# EasyEDA Pro project 数控电源.eprj, schematic 开关电源1号

## Sheets
1 CORE: Board Name: 开关电源一号; Create Date: 2025-11-23; Page Name: CORE; Project Name: 数控电源; Schematic Name: 开关电源1号; Update Date: 2025-11-23; Company: 嘉立创EDA; Page Size: A4; Version: V1.0
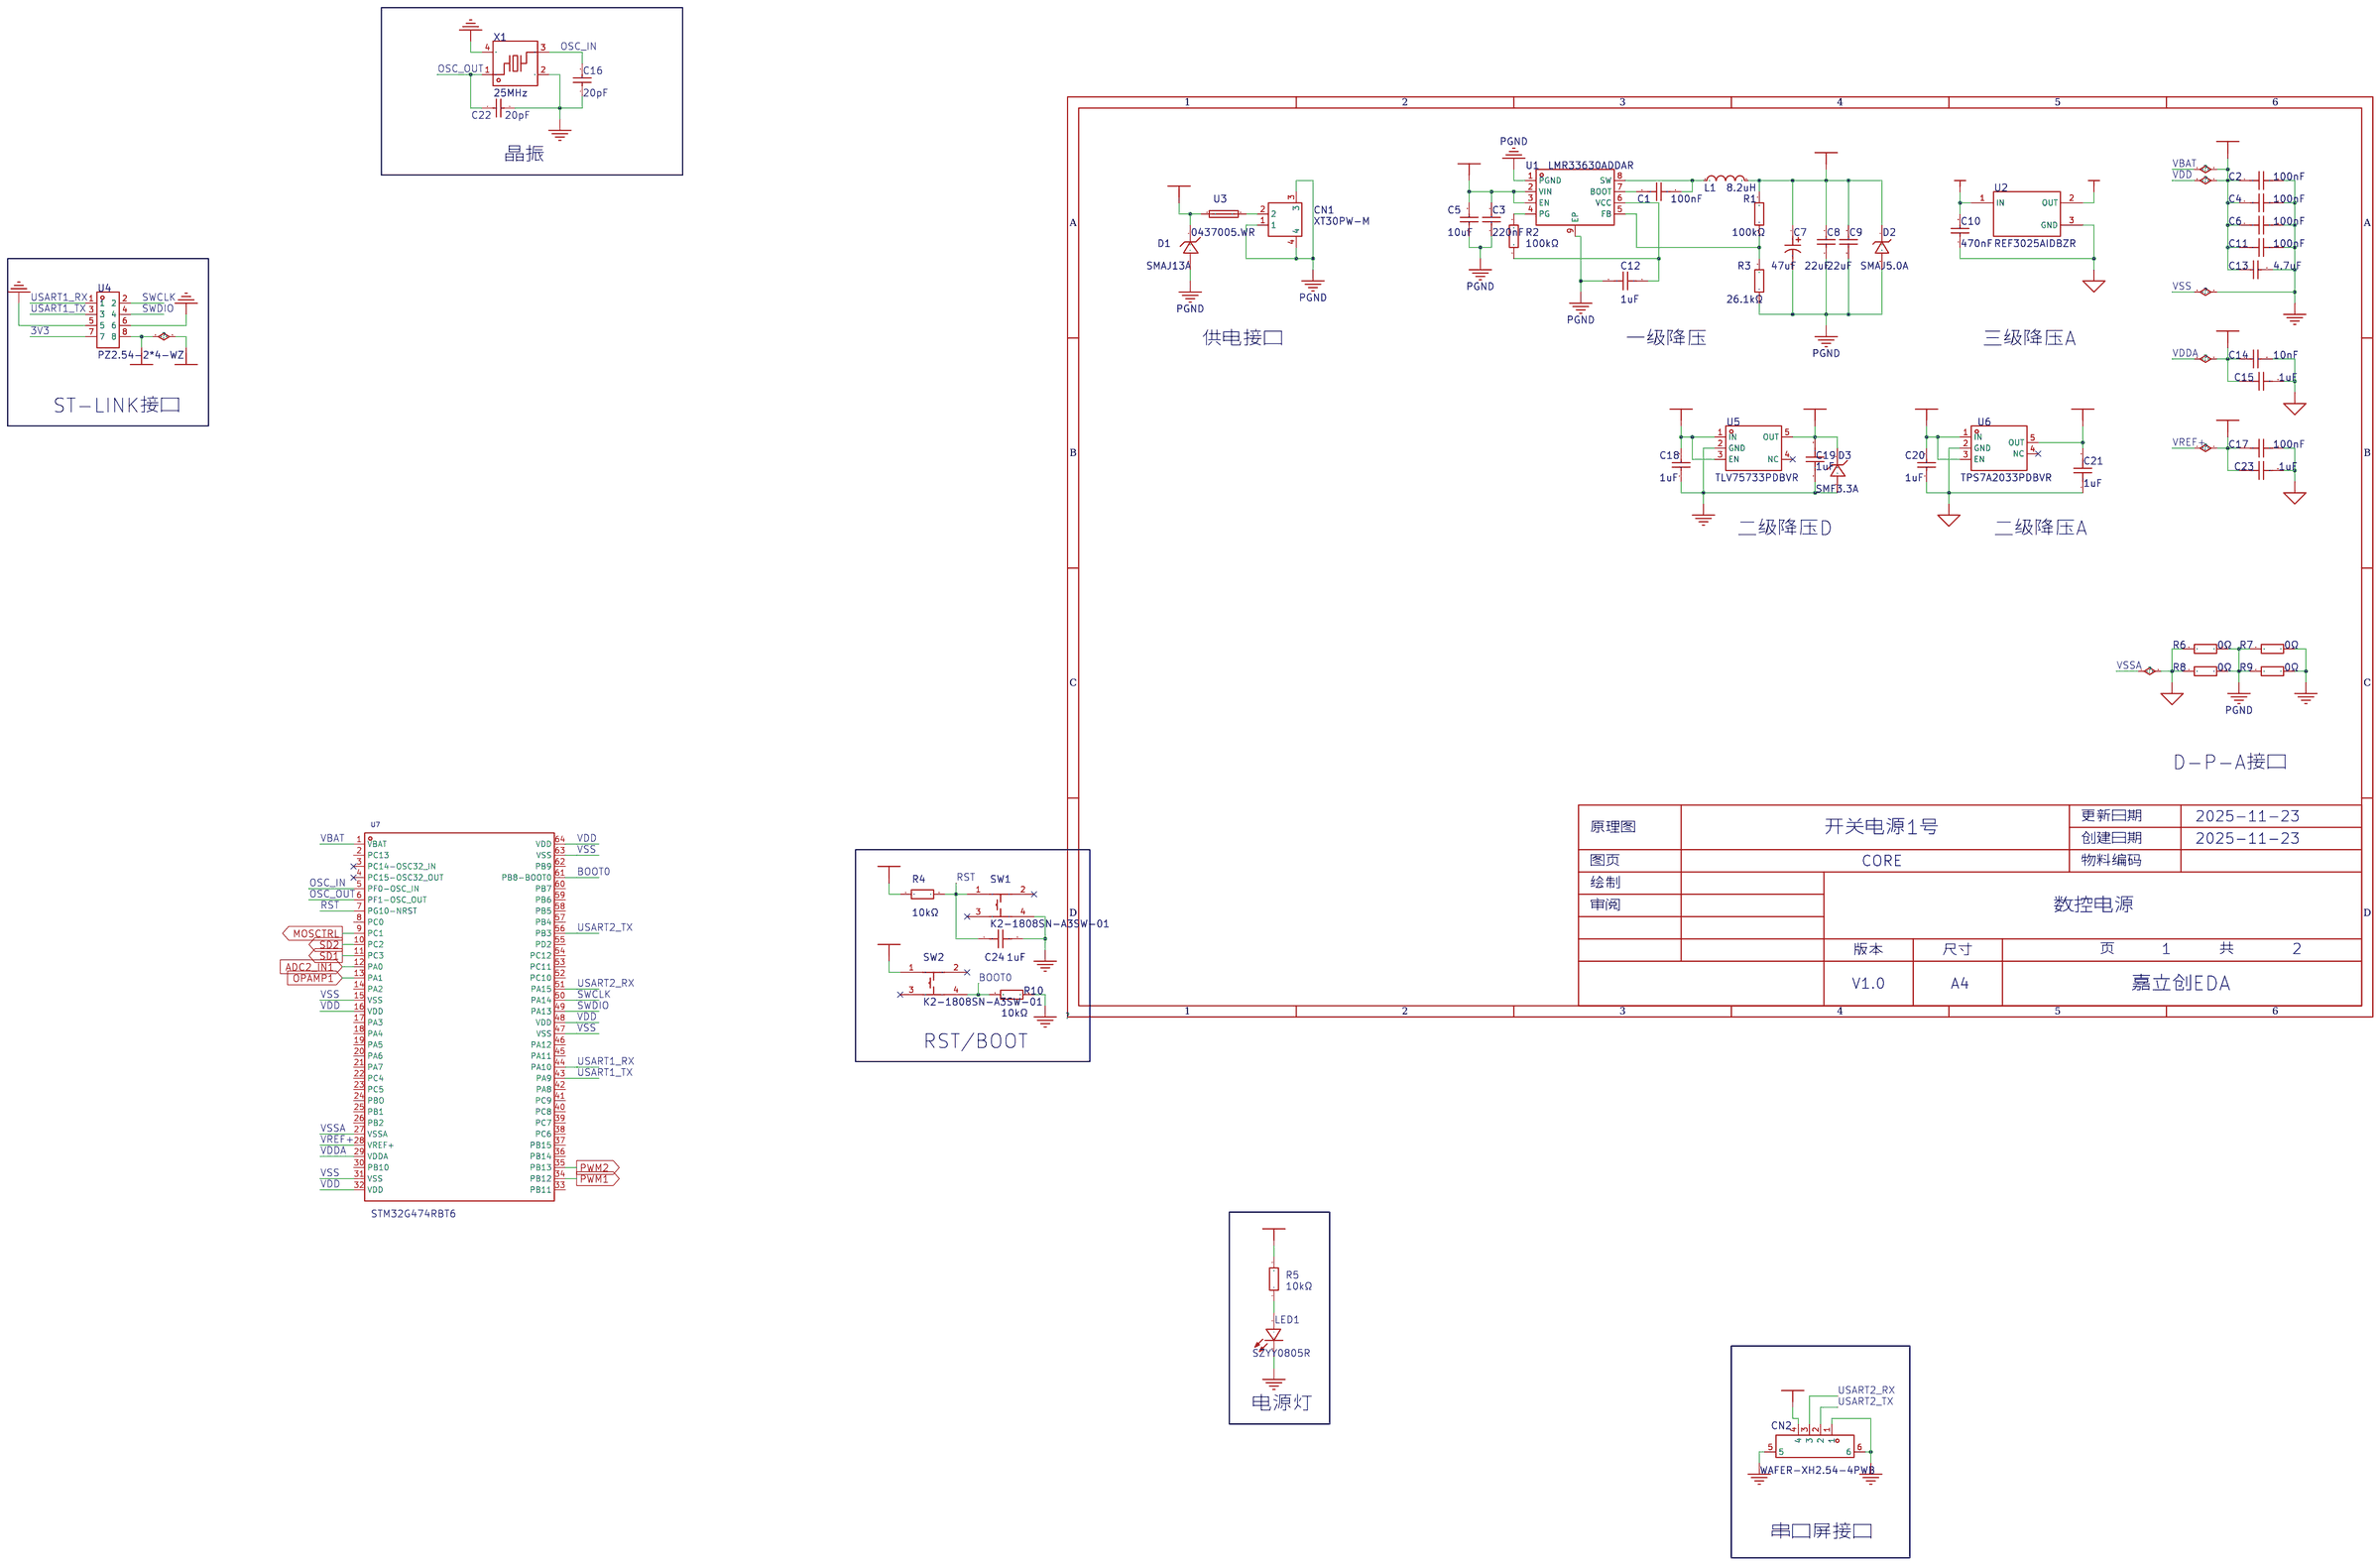
[diagram p0: CORE]
2 POWER: Page Name: POWER
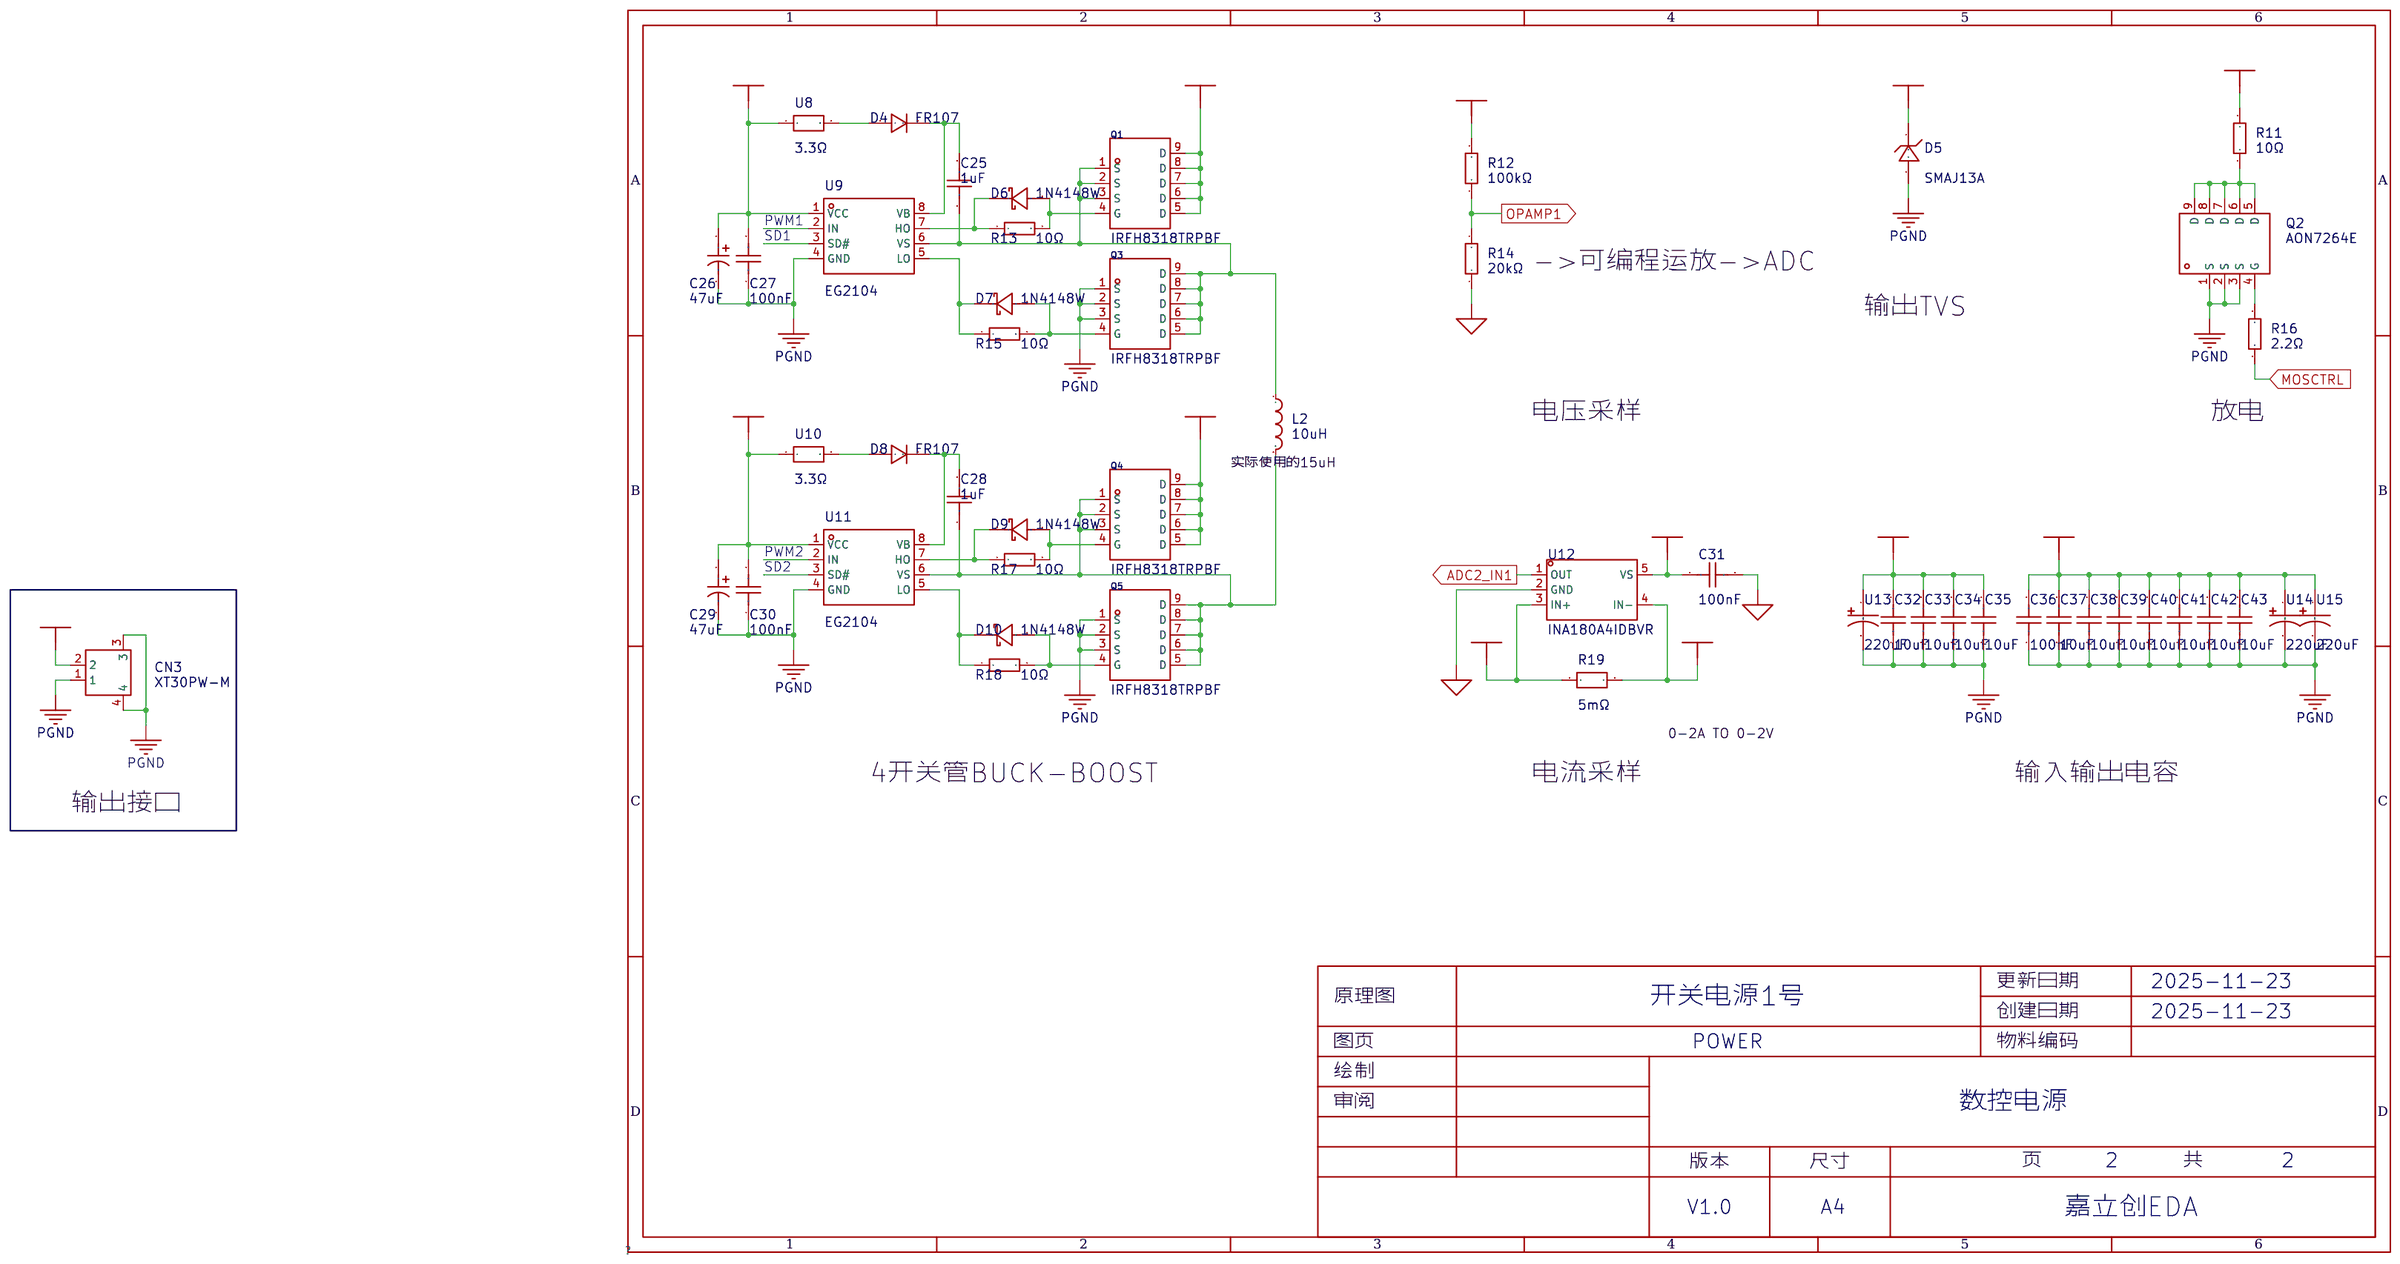
[diagram p1: POWER]

## Parts
sheet CORE
C1  100nF  [c0603]
C2  100nF  [c0603]
C3  220nF  [C0603]
C4  100nF  [c0603]
C5  10uF  [C1206]
C6  100nF  [c0603]
C7  47uF  [CAP-SMD_BD6.3-L6.6-W6.6-LS7.2-FD]
C8  22uF  [C1206]
C9  22uF  [C1206]
C10  470nF  [C0603]
C11  100nF  [c0603]
C12  1uF  [c0603]
C13  4.7uF  [C0603]
C14  10nF  [C0603]
C15  1uF  [c0603]
C16  20pF  [C0603]
C17  100nF  [c0603]
C18  1uF  [C0805]
C19  1uF  [c0603]
C20  1uF  [C0805]
C21  1uF  [c0603]
C22  20pF  [C0603]
C23  1uF  [c0603]
C24  1uF  [c0603]
CN1  XT30PW-M  [CONN-TH_XT30PW-M]
CN2  WAFER-XH2.54-4PWB  [CONN-TH_4P-P0.20_XUNPU_WAFER-XH2.54-4PWB]
D1  SMAJ13A  [SMA_L4.3-W2.7-LS5.1-RD]
D2  SMAJ5.0A  [SMA_L4.3-W2.5-LS5.0-RD]
D3  SMF3.3A  [SOD-123_L2.8-W1.8-LS3.7-RD]
L1  8.2uH  [IND-SMD_L7.0-W6.6_FXL0630]
LED1  SZYY0805R  [LED0805-R-RD]
R1  100kΩ  [R0603]
R2  100kΩ  [R0603]
R3  26.1kΩ  [R0603]
R4  10kΩ  [R0603]
R5  10kΩ  [R0603]
R6  0Ω  [R1206]
R7  0Ω  [R1206]
R8  0Ω  [R1206]
R9  0Ω  [R1206]
R10  10kΩ  [R0603]
SW1  K2-1808SN-A3SW-01  [SW-SMD_4P-L4.2-W3.3-P2.15-LS5.1]
SW2  K2-1808SN-A3SW-01  [SW-SMD_4P-L4.2-W3.3-P2.15-LS5.1]
U1  LMR33630ADDAR  [ESOP-8_L4.9-W3.9-P1.27-LS6.0-TL-EP]
U2  REF3025AIDBZR  [SOT-23-3_L2.9-W1.6-P1.90-LS2.8-BR]
U3  0437005.WR  [F1206]
U4  PZ2.54-2*4-WZ  [HDR-TH_8P-P2.54-H-M-R2-C4-S2.54-N]
U5  TLV75733PDBVR  [SOT-23-5_L2.9-W1.6-P0.95-LS2.8-BL]
U6  TPS7A2033PDBVR  [SOT-23-5_L2.9-W1.6-P0.95-LS2.8-BR]
U7  STM32G474RBT6  [LQFP-64_L10.0-W10.0-P0.50-LS12.0-BL]
X1  25MHz  [CRYSTAL-SMD_4P-L3.2-W2.5-BL]
sheet POWER
C25  1uF  [C1206]
C26  47uF  [CAP-SMD_BD6.3-L6.6-W6.6-LS7.2-FD]
C27  100nF  [c0603]
C28  1uF  [C1206]
C29  47uF  [CAP-SMD_BD6.3-L6.6-W6.6-LS7.2-FD]
C30  100nF  [c0603]
C31  100nF  [c0603]
C32  10uF  [C1206]
C33  10uF  [C1206]
C34  10uF  [C1206]
C35  10uF  [C1206]
C36  100nF  [c0603]
C37  10uF  [C1206]
C38  10uF  [C1206]
C39  10uF  [C1206]
C40  10uF  [C1206]
C41  10uF  [C1206]
C42  10uF  [C1206]
C43  10uF  [C1206]
CN3  XT30PW-M  [CONN-TH_XT30PW-M]
D4  FR107  [SOD-123_L2.8-W1.8-LS3.7-RD]
D5  SMAJ13A  [SMA_L4.3-W2.7-LS5.1-RD]
D6  1N4148W  [SOD-123_L2.7-W1.6-LS3.7-FD]
D7  1N4148W  [SOD-123_L2.7-W1.6-LS3.7-FD]
D8  FR107  [SOD-123_L2.8-W1.8-LS3.7-RD]
D9  1N4148W  [SOD-123_L2.7-W1.6-LS3.7-FD]
D10  1N4148W  [SOD-123_L2.7-W1.6-LS3.7-FD]
L2  10uH  [IND-SMD_L12.6-W13.5]
Q1  IRFH8318TRPBF  [PQFN-8_L5.8-W4.9-P1.27-LS6.0-BL-1]
Q2  AON7264E  [DFN-8_L3.0-W3.0-P0.65-BL]
Q3  IRFH8318TRPBF  [PQFN-8_L5.8-W4.9-P1.27-LS6.0-BL-1]
Q4  IRFH8318TRPBF  [PQFN-8_L5.8-W4.9-P1.27-LS6.0-BL-1]
Q5  IRFH8318TRPBF  [PQFN-8_L5.8-W4.9-P1.27-LS6.0-BL-1]
R11  10Ω  [R2512]
R12  100kΩ  [R0603]
R13  10Ω  [R0603]
R14  20kΩ  [R0603]
R15  10Ω  [R0603]
R16  2.2Ω  [R0603]
R17  10Ω  [R0603]
R18  10Ω  [R0603]
R19  5mΩ  [RES-SMD_L6.4-W3.2-1]
U8  3.3Ω  [R0603]
U9  EG2104  [SOP-8_L5.0-W4.0-P1.27-LS6.2-BL]
U10  3.3Ω  [R0603]
U11  EG2104  [SOP-8_L5.0-W4.0-P1.27-LS6.2-BL]
U12  INA180A4IDBVR  [SOT-23-5_L3.0-W1.7-P0.95-LS2.8-BR]
U13  220uF  [CAP-SMD_BD6.3-L6.6-W6.6-LS7.2-R-RD]
U14  220uF  [CAP-SMD_BD6.3-L6.6-W6.6-LS7.2-R-RD]
U15  220uF  [CAP-SMD_BD6.3-L6.6-W6.6-LS7.2-R-RD]

## Library data of the parts
C1 C2 C4 C6 C11 C17 C27 C30 C31 C36 = CC0603KRX7R9BB104: 容值:100nF;精度:±10%;额定电压:50V;材质(温度系数):X7R;; LCSC Part Name: 100nF ±10% 50V; Supplier Part: C14663; Manufacturer: YAGEO(国巨); Supplier Footprint: 0603; JLCPCB Part Class: Basic Part; Datasheet: https://atta.szlcsc.com/upload/public/pdf/source/20170116/1484561234239.pdf; Supplier: LCSC; Tolerance: ±10%; Voltage Rated: 50V; Temperature Coefficient: X7R
C3 = CL10B224KA8NNNC: 容值:220nF;精度:±10%;额定电压:25V;材质(温度系数):X7R;; LCSC Part Name: 220nF ±10% 25V; Supplier Part: C21120; Manufacturer: SAMSUNG(三星); Supplier Footprint: 0603; JLCPCB Part Class: 基础库; Datasheet: https://atta.szlcsc.com/upload/public/pdf/source/20160103/1457707705031.pdf; Supplier: LCSC; Tolerance: ±10%; Voltage Rated: 25V; Temperature Coefficient: X7R
C5 = CL31A106KBHNNNE: 容值:10uF;精度:±10%;额定电压:50V;材质(温度系数):X5R;; LCSC Part Name: 10uF ±10% 50V; Supplier Part: C13585; Manufacturer: SAMSUNG(三星); Supplier Footprint: 1206; JLCPCB Part Class: Basic Part; Datasheet: https://atta.szlcsc.com/upload/public/pdf/source/20160103/1457707668742.pdf; Supplier: LCSC; Tolerance: ±10%; Voltage Rated: 50V; Temperature Coefficient: X5R
C7 C26 C29 = RVT47UF35V67RV0039: 容值:47uF;精度:±20%;额定电压:35V;纹波电流:16.4mA@120Hz;等效串联电阻:-;; LCSC Part Name: 47uF ±20% 35V; Supplier Part: C2836440; Manufacturer: KNSCHA(科尼盛); Supplier Footprint: SMD,D6.3xL5.4mm; JLCPCB Part Class: 扩展库; Datasheet: https://atta.szlcsc.com/upload/public/pdf/source/20210528/C2836440_FB61BB3A7A46B9CC2A608A35871DBF0C.pdf; Supplier: LCSC; Tolerance: ±20%; Rated Voltage: 35V; Ripple Current: 16.4mA@120Hz; φD: 6.3mm; L: 5.4mm; Lifetime @ Temp: 2000hrs@105℃; Operating Temperature: -55℃~+105℃
C8 C9 = CL31A226KAHNNNE: 容值:22uF;精度:±10%;额定电压:25V;材质(温度系数):X5R;; LCSC Part Name: 22uF ±10% 25V; Supplier Part: C12891; Manufacturer: SAMSUNG(三星); Supplier Footprint: 1206; JLCPCB Part Class: 基础库; Datasheet: https://atta.szlcsc.com/upload/public/pdf/source/20160218/1457707763339.pdf; Supplier: LCSC; Tolerance: ±10%; Voltage Rated: 25V; Temperature Coefficient: X5R
C10 = CL10B474KA8NNNC: 容值:470nF;精度:±10%;额定电压:25V;材质(温度系数):X7R;; LCSC Part Name: 470nF ±10% 25V; Supplier Part: C1623; Manufacturer: SAMSUNG(三星); Supplier Footprint: 0603; JLCPCB Part Class: 基础库; Datasheet: https://atta.szlcsc.com/upload/public/pdf/source/20160218/1457707763339.pdf; Supplier: LCSC; Tolerance: ±10%; Voltage Rated: 25V; Temperature Coefficient: X7R
C12 C15 C19 C21 C23 = CL10A105KB8NNNC: 容值:1uF;精度:±10%;额定电压:50V;材质(温度系数):X5R;; LCSC Part Name: 1uF ±10% 50V; Supplier Part: C15849; Manufacturer: SAMSUNG(三星); Supplier Footprint: 0603; JLCPCB Part Class: 基础库; Datasheet: https://atta.szlcsc.com/upload/public/pdf/source/20160103/1457707679084.pdf; Supplier: LCSC; Tolerance: ±10%; Voltage Rated: 50V; Temperature Coefficient: X5R
C13 = CL10A475KO8NNNC: 容值:4.7uF;精度:±10%;额定电压:16V;材质(温度系数):X5R;; LCSC Part Name: 4.7uF ±10% 16V; Supplier Part: C19666; Manufacturer: SAMSUNG(三星); Supplier Footprint: 0603; JLCPCB Part Class: 基础库; Datasheet: https://atta.szlcsc.com/upload/public/pdf/source/20160218/1457707763339.pdf; Supplier: LCSC; Tolerance: ±10%; Voltage Rated: 16V; Temperature Coefficient: X5R
C14 = CC0603KRX7R9BB103: 容值:10nF;精度:±10%;额定电压:50V;材质(温度系数):X7R;; LCSC Part Name: 10nF ±10% 50V; Supplier Part: C100042; Manufacturer: YAGEO(国巨); Supplier Footprint: 0603; Datasheet: https://atta.szlcsc.com/upload/public/pdf/source/20180326/C100042_E8B0111D51DE3671A0A4A59FBCEFE81C.pdf; Supplier: LCSC; Tolerance: ±10%; Voltage Rated: 50V; Temperature Coefficient: X7R
C16 C22 = CC0603JRNPO9BN200: 容值:20pF;精度:±5%;额定电压:50V;材质(温度系数):NP0;; LCSC Part Name: 20pF ±5% 50V; Supplier Part: C105621; Manufacturer: YAGEO(国巨); Supplier Footprint: 0603; JLCPCB Part Class: 扩展库; Datasheet: https://atta.szlcsc.com/upload/public/pdf/source/20170505/1493957838062.pdf; Supplier: LCSC; Tolerance: ±5%; Voltage Rated: 50V; Temperature Coefficient: NP0
C18 C20 = CL21B105KBFNNNE: 容值:1uF;精度:±10%;额定电压:50V;材质(温度系数):X7R;; LCSC Part Name: 1uF ±10% 50V; Supplier Part: C28323; Manufacturer: SAMSUNG(三星); Supplier Footprint: 0805; JLCPCB Part Class: 基础库; Datasheet: https://atta.szlcsc.com/upload/public/pdf/source/20160218/1457707763339.pdf; Supplier: LCSC; Tolerance: ±10%; Voltage Rated: 50V; Temperature Coefficient: X7R
C24 = CL10A105KB8NNNC: 容值:1uF;精度:±10%;额定电压:50V;材质(温度系数):X5R;; LCSC Part Name: 1uF ±10% 50V; Supplier Part: C15849; Manufacturer: SAMSUNG(三星); Supplier Footprint: 0603; JLCPCB Part Class: 基础库; Datasheet: https://atta.szlcsc.com/upload/public/pdf/source/20160218/1457707763339.pdf; Supplier: LCSC; Tolerance: ±10%; Voltage Rated: 50V; Temperature Coefficient: X5R
CN1 CN3 = XT30PW-M: 类别:-;类型1:-;; LCSC Part Name: AMASS(艾迈斯)航模插头 卧式弯脚 XT30PW-M公头; Supplier Part: C431092; Manufacturer: AMASS(艾迈斯); JLCPCB Part Class: 扩展库; Datasheet: https://atta.szlcsc.com/upload/public/pdf/source/20220222/6A9F22F7850E25B33E1BE430ADF8560B.pdf; Supplier: LCSC; Brand: 艾迈斯; Type: 航模插头; RatedVoltage: DC 500V; InterfaceType: 公头; RatedCurrent: 15A; RecommendedWireGauge: 16/18/20AWG; contact resistance: 1.2mΩ; specifications: 2pin
CN2 = WAFER-XH2.54-4PWB: LCSC Part Name: XH2.54mm 4P 卧贴; Supplier Part: C3029478; Manufacturer: XUNPU(讯普); Supplier Footprint: SMD,P=2.5mm; Datasheet: https://atta.szlcsc.com/upload/public/pdf/source/20220527/7ACD2214A426F03D9ACD52F5A71E518C.pdf; Supplier: LCSC
D1 D5 = SMAJ13A_C908767: 反向截止电压(Vrwm):13V;最大钳位电压:21.5V;峰值脉冲电流(Ipp)@10/1000us:18.6A;击穿电压:14.4V;; LCSC Part Name: 单向TVS 13V截止 18.6A峰值脉冲; Supplier Part: C908767; Manufacturer: GOODWORK(固得沃克); Supplier Footprint: SMA(DO-214AC); JLCPCB Part Class: 扩展库; Datasheet: https://atta.szlcsc.com/upload/public/pdf/source/20201231/C908757_5436EAF671B686EFC2F0DD2098F0ED89.pdf; Supplier: LCSC; Reverse Stand-Off Voltage (Vrwm): 13V; Maximum Clamping Voltage: 21.5V; Peak Pulse Current (Ipp)@10/1000us: 18.6A; Breakdown Voltage: 14.4V; Reverse Leakage Current (Ir): 5uA; Type: TVS
D2 = SMAJ5.0A_C726731: LCSC Part Name: 单向TVS 5V截止 43.5A峰值脉冲; Supplier Part: C726731; Manufacturer: TWGMC(台湾迪嘉); Supplier Footprint: SMA(DO-214AC); JLCPCB Part Class: 扩展库; Datasheet: https://atta.szlcsc.com/upload/public/pdf/source/20200827/C726731_3930C18E0BE7F90724BF034A8102E5CA.pdf; Supplier: LCSC
D3 = SMF3.3A_C283866: 反向截止电压(Vrwm):3.3V;最大钳位电压:8V;峰值脉冲电流(Ipp)@10/1000us:25A;击穿电压:5.2V;; Supplier Part: C283866; Manufacturer: DOWO(东沃); Supplier Footprint: SOD-123FL; JLCPCB Part Class: 扩展库; Datasheet: https://atta.szlcsc.com/upload/public/pdf/source/20240321/1BA336232F2D97E4B026619682DB80D3.pdf; Supplier: LCSC; Reverse Stand-Off Voltage (Vrwm): 3.3V; Maximum Clamping Voltage: 8V; Peak Pulse Current (Ipp)@10/1000us: 25A; Breakdown Voltage: 5.2V; Reverse Leakage Current (Ir): 600uA; Type: TVS
L1 = FXL0630-8R2-M: 电感值:8.2uH;精度:±20%;额定电流:5A;饱和电流(Isat):6A;类型:一体成型电感;; LCSC Part Name: 8.2uH ±20% 6A; Supplier Part: C167222; Manufacturer: cjiang(长江微电); Supplier Footprint: SMD,6.6x7mm; JLCPCB Part Class: 扩展库; Datasheet: https://atta.szlcsc.com/upload/public/pdf/source/20230516/3A080F5AF8C87BB81C3BA86E5F60E51A.pdf; Supplier: LCSC; Tolerance: ±20%; Rated Current: 5A; Saturation Current (Isat): 6A; DC Resistance (DCR): 60mΩ; Type: 一体成型电感
LED1 = SZYY0805R: 发光颜色:红色;功率:40mW;正向电流:10mA;主波长:615nm~630nm;二极管配置:-;透镜颜色:无色透明透镜;色温:-;发光角度:120°;载带方式:-;工作温度:-40℃~+85℃;; LCSC Part Name: 红灯; Supplier Part: C434431; Manufacturer: yongyu(永裕光电); Supplier Footprint: 0805; JLCPCB Part Class: 扩展库; Datasheet: https://atta.szlcsc.com/upload/public/pdf/source/20191204/C434431_431C171B758FE4C37FA40B1B295AA7AB.pdf; Supplier: LCSC; Emitted Color: 红色; Power Dissipation: 40mW; Forward Current: 10mA; Dominant Wavelength: 615nm~630nm; Peak Wavelength: 645nm; Lens Color: 无色透明透镜; Viewing Angle: 120°; Operating Temperature: -40℃~+85℃
R1 R2 R12 = RC0603FR-07100KL: 电阻类型:厚膜电阻;阻值:100kΩ;精度:±1%;功率:100mW;最大工作电压:75V;温度系数:±100ppm/℃;; LCSC Part Name: 厚膜电阻 100kΩ ±1% 100mW; Supplier Part: C14675; Manufacturer: YAGEO(国巨); Supplier Footprint: 0603; JLCPCB Part Class: 扩展库; Datasheet: https://atta.szlcsc.com/upload/public/pdf/source/20140324/1457707028752.pdf; Supplier: LCSC; Type: 厚膜电阻; Tolerance: ±1%; Power(Watts): 100mW; Overload Voltage (Max): 75V; Temperature Coefficient: ±100ppm/℃; Operating Temperature Range: -55℃~+155℃
R3 = 0603WAF2612T5E: 电阻类型:厚膜电阻;阻值:26.1kΩ;精度:±1%;功率:100mW;最大工作电压:75V;温度系数:±100ppm/℃;; LCSC Part Name: 26.1kΩ ±1% 100mW 厚膜电阻; Supplier Part: C23356; Manufacturer: UNI-ROYAL(厚声); Supplier Footprint: 0603; JLCPCB Part Class: 扩展库; Datasheet: https://atta.szlcsc.com/upload/public/pdf/source/20200306/C422600_1E6D84923E4A46A82E41ADD87F860B5C.pdf; Supplier: LCSC; Type: 厚膜电阻; Tolerance: ±1%; Power(Watts): 100mW; Overload Voltage (Max): 75V; Temperature Coefficient: ±100ppm/℃; Operating Temperature Range: -55℃~+155℃
R4 R10 = 0603WAF1002T5E: 电阻类型:厚膜电阻;阻值:10kΩ;精度:±1%;功率:100mW;最大工作电压:75V;温度系数:±100ppm/℃;; LCSC Part Name: 厚膜电阻 10kΩ ±1% 100mW; Supplier Part: C25804; Manufacturer: UNI-ROYAL(厚声); Supplier Footprint: 0603; JLCPCB Part Class: 基础库; Datasheet: https://atta.szlcsc.com/upload/public/pdf/source/20200306/C422600_1E6D84923E4A46A82E41ADD87F860B5C.pdf; Supplier: LCSC; Type: 厚膜电阻; Tolerance: ±1%; Power(Watts): 100mW; Temperature Coefficient: ±100ppm/℃; Overload Voltage (Max): 75V; Operating Temperature Range: -55℃~+155℃
R5 = 0603WAF1002T5E: 电阻类型:厚膜电阻;阻值:10kΩ;精度:±1%;功率:100mW;; LCSC Part Name: 厚膜电阻 10kΩ ±1% 100mW; Supplier Part: C25804; Manufacturer: UNI-ROYAL(厚声); Supplier Footprint: 0603; Datasheet: https://atta.szlcsc.com/upload/public/pdf/source/20200306/C422600_1E6D84923E4A46A82E41ADD87F860B5C.pdf; Supplier: LCSC; Type: 厚膜电阻; Tolerance: ±1%; Power(Watts): 100mW; Temperature Coefficient: ±100ppm/℃; Overload Voltage (Max): 75V; Operating Temperature Range: -55℃~+155℃
R6-R9 = 1206W4F0000T5E: 电阻类型:厚膜电阻;阻值:0Ω;精度:±1%;功率:250mW;温度系数:±800ppm/℃;最大工作电压:200V;工作温度范围:-55℃~+155℃;; LCSC Part Name: 0Ω ±1% 250mW; Supplier Part: C17888; Manufacturer: UNI-ROYAL(厚声); Supplier Footprint: 1206; Supplier: LCSC; Type: 厚膜电阻; Tolerance: ±1%; Power(Watts): 250mW; Temperature Coefficient: ±800ppm/℃; Overload Voltage (Max): 200V; Operating Temperature Range: -55℃~+155℃
SW1 SW2 = K2-1808SN-A3SW-01: 作用力:180gf;安装方式:立贴;开关长度:4.2mm;开关宽度:3.25mm;开关高度:2.5mm;触点电流:50mA;额定电压(DC):12V;绝缘电阻:100MΩ;机械寿命:10万次;; LCSC Part Name: 3*4*2.5 贴片开关180G; Supplier Part: C2690012; Manufacturer: 韩国韩荣; Supplier Footprint: SMD; JLCPCB Part Class: 扩展库; Datasheet: https://atta.szlcsc.com/upload/public/pdf/source/20180927/C283535_7E7907F3E7B6C1691E1DC87E363D082A.pdf; Supplier: LCSC; Operating Force: 180gf; Mounting Style: 立贴; Switch Length: 4.2mm; Switch Width: 3.25mm; Switch Height: 2.5mm; Contact Current: 50mA; Voltage Rating (DC): 12V; Insulation Resistance: 100MΩ; Mechanical Life: 10万次; Operating Temperature: -25℃~+85℃
U1 = LMR33630ADDAR: 功能类型:降压型;输出类型:可调;输入电压:3.8V~36V;输出电压:1V~24V;输出电流(最大值):3A;; Supplier Part: C841384; Manufacturer: TI(德州仪器); Supplier Footprint: ESOP-8; JLCPCB Part Class: 扩展库; Datasheet: https://www.ti.com/cn/lit/gpn/lmr33630; Supplier: LCSC; Function: 降压型; Output Type: 可调; Input Voltage: 3.8V~36V; Output Voltage: 1V~24V; Output Current (Max): 3A; Switching Frequency: 400kHz; Operating Temperature: -40℃~+125℃@(TJ); Synchronous Rectification: 是; Number of Outputs: 1; Topology: 降压式; Switch tube (built-in/external): 内置
U2 = REF3025AIDBZR: 输出类型:固定;输入电压:2.55V~5.5V;输出电流:25mA;精度:±0.2%;; LCSC Part Name: 串联 25mA; Supplier Part: C11334; Manufacturer: TI(德州仪器); Supplier Footprint: SOT-23; JLCPCB Part Class: 扩展库; Datasheet: https://atta.szlcsc.com/upload/public/pdf/source/20130225/1457706593773.pdf; Supplier: LCSC; Reference Type: 串联; Output Type: 固定; Input Voltage: 2.55V~5.5V; Output Current: 25mA; Tolerance: ±0.2%; Temperature Coefficient: 75ppm/℃; Supply Current: 50uA; Noise - 1/10Hz to 10Hz: 28uVp-p; Noise - 10Hz to 10kHz: 80uVrms; Operating Temperature: -40℃~+125℃@(Ta)
U3 = 0437005.WR: 类型:贴片式保险丝;额定电流:5A;额定电压 (AC):32V;额定电压 (DC):35V;分断能力:50A;; LCSC Part Name: 32V贴片式保险丝; Supplier Part: C99541; Manufacturer: Littelfuse(美国力特); Supplier Footprint: 1206; JLCPCB Part Class: 扩展库; Datasheet: https://atta.szlcsc.com/upload/public/pdf/source/20170322/1490151740362.pdf; Supplier: LCSC; Type: 贴片式保险丝; Current Rating: 5A; Voltage Rating  (AC): 32V; Voltage Rating (DC): 35V; Operating Temperature: -55℃~+150℃; Breaking Capacity: 50A
U4 = PZ2.54-2*4-WZ: LCSC Part Name: 双排弯针 2*4 2.54 镀金环保UL认证; Supplier Part: C5360908; Manufacturer: ZHOURI(洲日); Supplier Footprint: DIP; Supplier: LCSC
U5 = TLV75733PDBVR: 输出类型:固定;最大输入电压:5.5V;输出电压:3.3V;最大输出电流:1A;电源纹波抑制比(PSRR):52dB;输出极性:正极;; LCSC Part Name: 输入5.5V 输出3.3V 1A; Supplier Part: C485517; Manufacturer: TI(德州仪器); Supplier Footprint: SOT-23-5; JLCPCB Part Class: 扩展库; Datasheet: https://www.ti.com/cn/lit/gpn/tlv757p; Supplier: LCSC; Output Type: 固定; Maximum Input Voltage: 5.5V; Output Voltage: 3.3V; MAX Output Current: 1A; Power Supply Rejection Ratio (PSRR): 52dB; Dropout Voltage: 475mV@(1A); Operating Temperature: -40℃~+125℃@(Tj); Output Polarity: 正极; Number of Outputs: 1
U6 = TPS7A2033PDBVR: 输出类型:固定;最大输入电压:6V;输出电压:3.3V;最大输出电流:300mA;输出极性:正极;; Supplier Part: C2862740; Manufacturer: TI(德州仪器); Supplier Footprint: SOT-23-5; JLCPCB Part Class: 扩展库; Datasheet: https://www.ti.com/cn/lit/gpn/tps7a20; Supplier: LCSC; Output Type: 固定; Maximum Input Voltage: 6V; Output Voltage: 3.3V; MAX Output Current: 300mA; Dropout Voltage: 140mV@(300mA); standby current: 15uA; Operating Temperature: -40℃~+125℃@(Tj); Output Polarity: 正极; Number of Outputs: 1
U7 = STM32G474RBT6: CPU内核:CM4;程序存储容量:128KB;RAM总容量:128KB;GPIO端口数量:52;工作电压范围:1.71V~3.6V;CPU最大主频:170MHz;程序存储器类型:FLASH;; Supplier Part: C529413; Manufacturer: ST(意法半导体); Supplier Footprint: LQFP-64(10x10); JLCPCB Part Class: 扩展库; Datasheet: https://atta.szlcsc.com/upload/public/pdf/source/20200511/C529413_E65C05BC9222C60DA6E2B31FEBB7BDD5.pdf; Supplier: LCSC; CPU Core: CM4; Program Storage Size: 128KB; RAM Size: 128KB; GPIO Ports Number: 52; Operating Voltage Range: 1.71V~3.6V; CPU Maximum Speed: 170MHz; Program Memory Type: FLASH; Operating Temperature Range: -40℃~+85℃; ADC (Bit): 12bit; DAC (Bit): 12bit; Peripheral/Function: DMA；PWM; Internal Oscillator: 有
X1 = XL2EL89CSI-111YLC-25M: 晶振类型:贴片晶振;频率:25MHz;常温频差:±10ppm;外接负载电容:20pF;频率稳定度(全温):±20ppm;; LCSC Part Name: 25MHz ±10ppm 20pF YSX321SL; Supplier Part: C5280577; Manufacturer: YXC(扬兴晶振); Supplier Footprint: SMD3225-4P; JLCPCB Part Class: 扩展库; Datasheet: https://atta.szlcsc.com/upload/public/pdf/source/20240329/19D5F850207469550BEB00D7DFEDBC7A.pdf; Supplier: LCSC; Crystal Type: 贴片晶振; Normal temperature Frequency Tolerance: ±10ppm; External load capacitor: 20pF; Frequency Stability(Full temperature range): ±20ppm; Operating Temperature: -40℃~+85℃
C25 C28 = CL31B105KBHNNNE: 容值:1uF;精度:±10%;额定电压:50V;材质(温度系数):X7R;; LCSC Part Name: 1uF ±10% 50V; Supplier Part: C1848; Manufacturer: SAMSUNG(三星); Supplier Footprint: 1206; JLCPCB Part Class: 基础库; Datasheet: https://atta.szlcsc.com/upload/public/pdf/source/20160218/1457707763339.pdf; Supplier: LCSC; Tolerance: ±10%; Voltage Rated: 50V; Temperature Coefficient: X7R
C32-C35 C37-C43 = 1206X106M250NT: 容值:10uF;精度:±20%;额定电压:25V;材质(温度系数):X5R;; LCSC Part Name: 10uF ±20% 25V; Supplier Part: C93059; Manufacturer: FH(风华); Supplier Footprint: 1206; JLCPCB Part Class: 扩展库; Datasheet: https://atta.szlcsc.com/upload/public/pdf/source/20200305/C486355_26A10D38EF8C2A5C37091D0039909270.pdf; Supplier: LCSC; Tolerance: ±20%; Voltage Rated: 25V; Temperature Coefficient: X5R
D4 D8 = FR107_C511885: 二极管配置:-;正向压降(Vf):1.3V@1A;直流反向耐压(Vr):1kV;平均整流电流(Io):1A;反向恢复时间(trr):500ns;; LCSC Part Name: 电压:1kV 电流:1A; Supplier Part: C511885; Manufacturer: BORN(伯恩半导体); Supplier Footprint: SOD-123; JLCPCB Part Class: 扩展库; Datasheet: https://atta.szlcsc.com/upload/public/pdf/source/20200413/C511885_F5BBF7A87475723E74BE0D118A106A7A.pdf; Supplier: LCSC; Forward Voltage (Vf@If): 1.3V@1A; Reverse Voltage (Vr): 1kV; Average Rectified Current (Io): 1A; Reverse Leakage Current: 5uA@1kV; Reverse Recovery Time (trr): 500ns; Operating Temperature: -55℃~+150℃@(Tj)
D6 D7 D9 D10 = 1N4148W_C7420318: 二极管配置:独立式;正向压降(Vf):1.25V@150mA;直流反向耐压(Vr):100V;平均整流电流(Io):150mA;功率:400mW;反向恢复时间(trr):4ns;; LCSC Part Name: 电压:100V 电流:150mA; Supplier Part: C7420318; Manufacturer: 宏迦橙; Supplier Footprint: SOD-123; JLCPCB Part Class: 扩展库; Datasheet: https://atta.szlcsc.com/upload/public/pdf/source/20230828/E5C3F7A4272052930A7E03B75759BF50.pdf; Supplier: LCSC; Diode Configuration: 独立式; Forward Voltage (Vf@If): 1.25V@150mA; Reverse Voltage (Vr): 100V; Average Rectified Current (Io): 150mA; Power Dissipation: 400mW; Reverse Leakage Current: 1uA@75V; Reverse Recovery Time (trr): 4ns; Operating Temperature: -55℃~+150℃
L2 = FXL1350-100-M: 电感值:10uH;精度:±20%;额定电流:9A;饱和电流(Isat):12A;类型:一体成型电感;; LCSC Part Name: 10uH ±20% 12A; Supplier Part: C526017; Manufacturer: cjiang(长江微电); Supplier Footprint: SMD,12.6x13.5mm; JLCPCB Part Class: 扩展库; Datasheet: https://atta.szlcsc.com/upload/public/pdf/source/20230516/5C3554F445A96E3BB40F3C77DED6E9EE.pdf; Supplier: LCSC; Tolerance: ±20%; Rated Current: 9A; Saturation Current (Isat): 12A; DC Resistance (DCR): 22mΩ; Type: 一体成型电感
Q1 Q3-Q5 = IRFH8318TRPBF: 类型:N沟道;漏源电压(Vdss):30V;连续漏极电流(Id):27A;功率(Pd):3.6W;导通电阻(RDS(on)@Vgs,Id):3.1mΩ@10V,20A;阈值电压(Vgs(th)@Id):2.35V@50uA;; LCSC Part Name: N沟道 耐压:30V 电流:27A; Supplier Part: C82059; Manufacturer: Infineon(英飞凌); Supplier Footprint: PQFN-8(4.9x5.8); JLCPCB Part Class: 扩展库; Datasheet: https://atta.szlcsc.com/upload/public/pdf/source/20180112/C82059_15157259645841261846.pdf; Supplier: LCSC; Type: N沟道; Drain Source Voltage (Vdss): 30V; Continuous Drain Current (Id): 27A; Power Dissipation (Pd): 3.6W; Drain Source On Resistance (RDS(on)@Vgs,Id): 3.1mΩ@10V,20A; Gate Threshold Voltage (Vgs(th)@Id): 2.35V@50uA
Q2 = AON7264E: 类型:1个N沟道;漏源电压(Vdss):60V;连续漏极电流(Id):28A;功率(Pd):27.5W;导通电阻(RDS(on)@Vgs,Id):9.5mΩ@10V,17A;阈值电压(Vgs(th)@Id):2.4V@250uA;; LCSC Part Name: 1个N沟道 耐压:60V 电流:28A; Supplier Part: C431191; Manufacturer: AOS; Supplier Footprint: DFN-8(3x3); JLCPCB Part Class: 扩展库; Datasheet: https://atta.szlcsc.com/upload/public/pdf/source/20190920/C431191_248E54C69EE27CAC0386D4DBB2EA119E.pdf; Supplier: LCSC; Type: 1个N沟道; Drain Source Voltage (Vdss): 60V; Continuous Drain Current (Id): 28A; Power Dissipation (Pd): 27.5W; Drain Source On Resistance (RDS(on)@Vgs,Id): 9.5mΩ@10V,17A; Gate Threshold Voltage (Vgs(th)@Id): 2.4V@250uA; Total Gate Charge (Qg@Vgs): 25nC@10V; Input Capacitance (Ciss@Vds): 1.1nF@30V; Operating Temperature: -55℃~+150℃@(Tj)
R11 = 25121WF100JT4E: 电阻类型:厚膜电阻;阻值:10Ω;精度:±1%;功率:1W;最大工作电压:200V;温度系数:±400ppm/℃;; LCSC Part Name: 10Ω ±1% 1W 厚膜电阻; Supplier Part: C47019; Manufacturer: UNI-ROYAL(厚声); Supplier Footprint: 2512; JLCPCB Part Class: 扩展库; Datasheet: https://atta.szlcsc.com/upload/public/pdf/source/20200306/C422600_1E6D84923E4A46A82E41ADD87F860B5C.pdf; Supplier: LCSC; Type: 厚膜电阻; Tolerance: ±1%; Power(Watts): 1W; Overload Voltage (Max): 200V; Temperature Coefficient: ±400ppm/℃; Operating Temperature Range: -55℃~+155℃
R13 R15 R17 R18 = 0603WAF100JT5E: 电阻类型:厚膜电阻;阻值:10Ω;精度:±1%;功率:100mW;; LCSC Part Name: 10Ω ±1% 100mW; Supplier Part: C22859; Manufacturer: UNI-ROYAL(厚声); Supplier Footprint: 0603; JLCPCB Part Class: 基础库; Datasheet: https://atta.szlcsc.com/upload/public/pdf/source/20200306/C422600_1E6D84923E4A46A82E41ADD87F860B5C.pdf; Supplier: LCSC; Type: 厚膜电阻; Tolerance: ±1%; Power(Watts): 100mW; Temperature Coefficient: ±400ppm/℃; Overload Voltage (Max): 75V; Operating Temperature Range: -55℃~+155℃
R14 = 0603WAF2002T5E: 电阻类型:厚膜电阻;阻值:20kΩ;精度:±1%;功率:100mW;; LCSC Part Name: 20kΩ ±1% 100mW; Supplier Part: C4184; Manufacturer: UNI-ROYAL(厚声); Supplier Footprint: 0603; Datasheet: https://atta.szlcsc.com/upload/public/pdf/source/20200306/C422600_1E6D84923E4A46A82E41ADD87F860B5C.pdf; Supplier: LCSC; Type: 厚膜电阻; Tolerance: ±1%; Power(Watts): 100mW; Temperature Coefficient: ±100ppm/℃; Overload Voltage (Max): 75V; Operating Temperature Range: -55℃~+155℃
R16 = 0603WAF220KT5E: 电阻类型:厚膜电阻;阻值:2.2Ω;精度:±1%;功率:100mW;最大工作电压:75V;温度系数:±400ppm/℃;; LCSC Part Name: 2.2Ω ±1% 100mW 厚膜电阻; Supplier Part: C22939; Manufacturer: UNI-ROYAL(厚声); Supplier Footprint: 0603; JLCPCB Part Class: 基础库; Datasheet: https://atta.szlcsc.com/upload/public/pdf/source/20200306/C422600_1E6D84923E4A46A82E41ADD87F860B5C.pdf; Supplier: LCSC; Type: 厚膜电阻; Tolerance: ±1%; Power(Watts): 100mW; Overload Voltage (Max): 75V; Temperature Coefficient: ±400ppm/℃; Operating Temperature Range: -55℃~+155℃
R19 = HoJLR2512-3W-5mR-1%: 电阻类型:采样电阻;阻值:5mΩ;精度:±1%;功率:3W;安装方式:贴片;; LCSC Part Name: 5mΩ ±1% 3W; Supplier Part: C2903482; Manufacturer: Milliohm(毫欧); Supplier Footprint: 2512; JLCPCB Part Class: 扩展库; Datasheet: https://atta.szlcsc.com/upload/public/pdf/source/20211009/7525CABAB363C979E942C1DD41F1FEF0.pdf; Supplier: LCSC; Type: 采样电阻; Tolerance: ±1%; Power(Watts): 3W; Mounting Sytle: 贴片
U8 U10 = FRC0603F3R30TS: 电阻类型:厚膜电阻;阻值:3.3Ω;精度:±1%;功率:100mW;最大工作电压:75V;温度系数:±200ppm/℃;; LCSC Part Name: 3.3Ω ±1% 100mW 厚膜电阻; Supplier Part: C2930016; Manufacturer: FOJAN(富捷); Supplier Footprint: 0603; JLCPCB Part Class: Extended Part; Datasheet: https://atta.szlcsc.com/upload/public/pdf/source/20211221/925EC7D7225764EE0046F22065062C87.pdf; Supplier: LCSC; Type: 厚膜电阻; Tolerance: ±1%; Power(Watts): 100mW; Overload Voltage (Max): 75V; Temperature Coefficient: ±200ppm/℃; Operating Temperature Range: -55℃~+155℃
U9 U11 = EG2104: 高性价比, 600V，半桥式Nmos预驱动器; Supplier Part: C186697; Manufacturer: EG(屹晶微); Supplier Footprint: SOP-8; JLCPCB Part Class: 扩展库; Datasheet: https://atta.szlcsc.com/upload/public/pdf/source/20220627/4CCFA0CAB664067FEE4AF87E4129127F.pdf; Supplier: LCSC
U12 = INA180A4IDBVR: 放大器数:单路;; Supplier Part: C188337; Manufacturer: TI(德州仪器); Supplier Footprint: SOT-23-5; JLCPCB Part Class: 扩展库; Datasheet: https://www.ti.com/cn/lit/gpn/ina180; Supplier: LCSC; Number of Channels: 单路; Supply Current: 260uA; Operating Temperature: -40℃~+125℃
U13-U15 = KNM2220UF10V149EC0050: 容值:220uF;精度:±20%;额定电压:10V;纹波电流:2.65A@100kHz;等效串联电阻:35mΩ@100kHz;; LCSC Part Name: 220uF ±20% 10V; Supplier Part: C2982820; Manufacturer: KNSCHA(科尼盛); Supplier Footprint: SMD,D6.3xL7mm; JLCPCB Part Class: 扩展库; Datasheet: https://atta.szlcsc.com/upload/public/pdf/source/20220426/AA34ED61F14CE7DF5DACF58D719BFA3E.pdf; Supplier: LCSC; Tolerance: ±20%; Rated Voltage: 10V; Ripple Current: 2.65A@100kHz; Equivalent Series Resistance(ESR): 35mΩ@100kHz; Lead Spacing: 2.5mm; φD: 6.3mm; L: 7mm; Lifetime @ Temp: 2000hrs@105℃; Operating Temperature: -55℃~+105℃

## Nets
2V5A: C17.1 C23.1 U2.2(OUT) U7.28(VREF+)
3V3: C2.1 C4.1 C6.1 C11.1 C13.1 C19.2 D3.1 R4.1 R5.2 SW2.1 U4.7 U5.5(OUT) U7.1(VBAT) U7.16(VDD) U7.32(VDD) U7.48(VDD) U7.64(VDD)
3V3A: C10.2 C14.1 C15.1 C21.2 C31.1 U2.1(IN) U6.5(OUT) U7.29(VDDA) U12.5(VS)
4V8: C7.1 C8.2 C9.2 C18.2 C20.2 C26.1 C27.2 C29.1 C30.2 CN2.4 D2.1 L1.2 R1.2 U4.8 U5.1(IN) U5.3(EN) U6.1(IN) U6.3(EN) U8.1 U9.1(VCC) U10.1 U11.1(VCC)
AGND: C10.1 C14.2 C15.2 C17.2 C20.1 C21.1 C23.2 C31.2 R6.1 R8.1 R14.1 U2.3(GND) U6.2(GND) U7.27(VSSA) U12.2(GND)
GND: C2.2 C4.2 C6.2 C11.2 C13.2 C16.1 C18.1 C19.1 C22.1 C24.2 CN2.1 CN2.5 CN2.6 D3.2 LED1.2(-) R7.2 R9.2 R10.2 SW1.4 U4.5 U4.6 U5.2(GND) U7.15(VSS) U7.31(VSS) U7.47(VSS) U7.63(VSS) X1.2(GND) X1.4(GND)
PGND: C3.1 C5.1 C7.2 C8.1 C9.1 C12.2 C26.2 C27.1 C29.2 C30.1 C32.1 C33.1 C34.1 C35.1 C36.1 C37.1 C38.1 C39.1 C40.1 C41.1 C42.1 C43.1 CN1.1 CN1.3 CN1.4 CN3.1 CN3.3 CN3.4 D1.2(A) D2.2 D5.2(A) Q2.1(S) Q2.2(S) Q2.3(S) Q3.1(S) Q3.2(S) Q3.3(S) Q5.1(S) Q5.2(S) Q5.3(S) R3.1 R6.2 R7.1 R8.2 R9.1 U1.1(PGND) U1.9(EP) U9.4(GND) U11.4(GND) U13.2 U14.2 U15.2
VIN: C3.2 C5.2 C32.2 C33.2 C34.2 C35.2 D1.1(C) Q1.5(D) Q1.6(D) Q1.7(D) Q1.8(D) Q1.9(D) U1.2(VIN) U1.3(EN) U3.1 U13.1
ADC2_IN1: U7.12(PA0) U12.1(OUT)
BOOT0: R10.1 SW2.4 U7.61(PB8-BOOT0)
MOSCTRL: R16.1 U7.9(PC1)
OPAMP1: R12.1 R14.2 U7.13(PA1)
OSC_IN: C16.2 U7.5(PF0-OSC_IN) X1.3
OSC_OUT: C22.2 U7.6(PF1-OSC_OUT) X1.1
PWM1: U7.34(PB12) U9.2(IN)
PWM2: U7.35(PB13) U11.2(IN)
RST: C24.1 R4.2 SW1.1 U7.7(PG10-NRST)
SD1: U7.11(PC3) U9.3(SD#)
SD2: U7.10(PC2) U11.3(SD#)
SWCLK: U4.2 U7.50(PA14)
SWDIO: U4.4 U7.49(PA13)
USART1_RX: U4.1 U7.44(PA10)
USART1_TX: U4.3 U7.43(PA9)
USART2_RX: CN2.3 U7.51(PA15)
USART2_TX: CN2.2 U7.56(PB3)
VLOAD: CN3.2 D5.1(C) R11.2 R19.2 U12.4(IN-)
VOUT: C36.2 C37.2 C38.2 C39.2 C40.2 C41.2 C42.2 C43.2 Q4.5(D) Q4.6(D) Q4.7(D) Q4.8(D) Q4.9(D) R12.2 R19.1 U12.3(IN+) U14.1 U15.1
$1N8888: R2.2 U1.4(PG)
$1N9180: C12.1 R2.1 U1.6(VCC)
$1N9267: C1.1 U1.7(BOOT)
$1N9342: C1.2 L1.1 U1.8(SW)
$1N9435: R1.1 R3.2 U1.5(FB)
$1N23526: LED1.1(+) R5.1
$1N37471: CN1.2 U3.2
$2N765: D6.2(K) R13.1 U9.7(HO)
$2N797: D6.1(A) Q1.4(G) R13.2
$2N1199: D7.2(K) R15.1 U9.5(LO)
$2N1218: D7.1(A) Q3.4(G) R15.2
$2N1738: D4.2(A) U8.2
$2N2512: D9.2(K) R17.1 U11.7(HO)
$2N2535: D10.1(A) Q5.4(G) R18.2
$2N2547: D10.2(K) R18.1 U11.5(LO)
$2N2553: D9.1(A) Q4.4(G) R17.2
$2N2559: D8.2(A) U10.2
$2N7408: C25.1 L2.1 Q1.1(S) Q1.2(S) Q1.3(S) Q3.5(D) Q3.6(D) Q3.7(D) Q3.8(D) Q3.9(D) U9.6(VS)
$2N7455: C28.1 L2.2 Q4.1(S) Q4.2(S) Q4.3(S) Q5.5(D) Q5.6(D) Q5.7(D) Q5.8(D) Q5.9(D) U11.6(VS)
$2N11333: Q2.4(G) R16.2
$2N14237: Q2.5(D) Q2.6(D) Q2.7(D) Q2.8(D) Q2.9(D) R11.1
$2N27874: C25.2 D4.1(K) U9.8(VB)
$2N27929: C28.2 D8.1(K) U11.8(VB)

Not connected (* = marked no-connect by the designer): SW1 2* 3*; SW2 2* 3*; U5 4(NC)*; U6 4(NC)*; U7 2(PC13) 3(PC14-OSC32_IN)* 4(PC15-OSC32_OUT)* 8(PC0) 14(PA2) 17(PA3) 18(PA4) 19(PA5) 20(PA6) 21(PA7) 22(PC4) 23(PC5) 24(PBO) 25(PB1) 26(PB2) 30(PB10) 33(PB11) 36(PB14) 37(PB15) 38(PC6) 39(PC7) 40(PC8) 41(PC9) 42(PA8) 45(PA11) 46(PA12) 52(PC10) 53(PC11) 54(PC12) 55(PD2) 57(PB4) 58(PB5) 59(PB6) 60(PB7) 62(PB9)

## Notes on the sheets
sheet 1
- 晶振
- 供电接口
- 一级降压
- 三级降压A
- ST-LINK接口
- 二级降压D
- 二级降压A
- D-P-A接口
- RST/BOOT
- 电源灯
- 串口屏接口
sheet 2
- ->可编程运放->ADC
- 输出TVS
- 电压采样
- 放电
- 实际使用的15uH
- 0-2A TO 0-2V
- 4开关管BUCK-BOOST
- 电流采样
- 输入输出电容
- 输出接口
